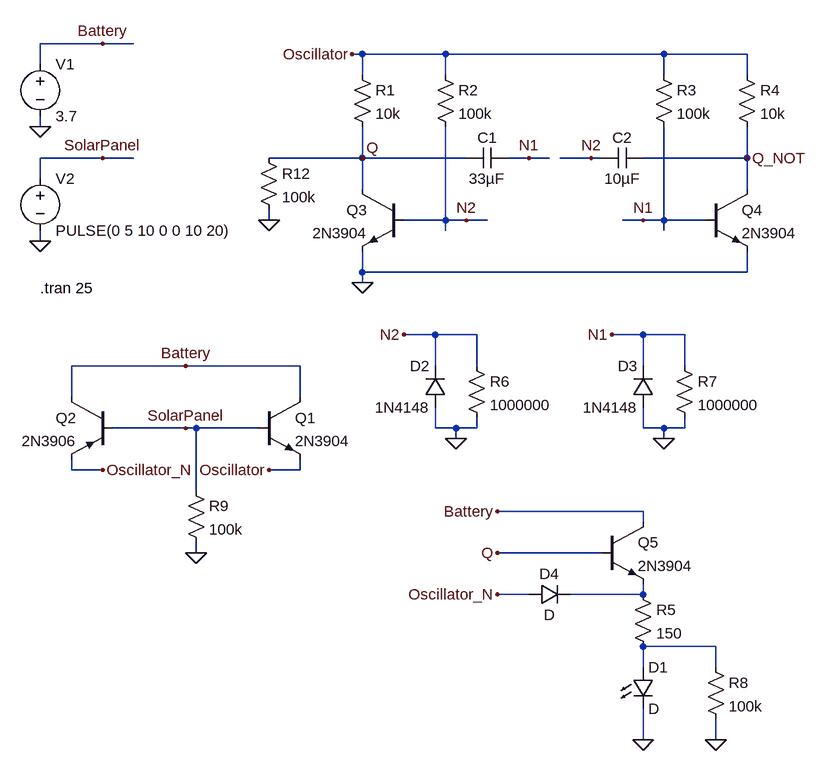
[diagram p0: schematic EE330_FinalProject_V2.asc]
EE330_FinalProject_V2.asc, the LTspice schematic file:
Version 4
SHEET 1 2304 1888
WIRE 256 32 160 32
WIRE 304 32 256 32
WIRE 656 48 640 48
WIRE 784 48 656 48
WIRE 1120 48 784 48
WIRE 1248 48 1120 48
WIRE 160 64 160 32
WIRE 656 80 656 48
WIRE 784 80 784 48
WIRE 1120 80 1120 48
WIRE 1248 80 1248 48
WIRE 160 160 160 144
WIRE 256 208 160 208
WIRE 304 208 256 208
WIRE 656 208 656 160
WIRE 656 208 512 208
WIRE 816 208 656 208
WIRE 912 208 880 208
WIRE 944 208 912 208
WIRE 1008 208 960 208
WIRE 1024 208 1008 208
WIRE 1248 208 1248 160
WIRE 1248 208 1088 208
WIRE 160 240 160 208
WIRE 656 256 656 208
WIRE 1248 256 1248 208
WIRE 512 304 512 288
WIRE 784 304 784 160
WIRE 784 304 720 304
WIRE 816 304 784 304
WIRE 848 304 816 304
WIRE 1088 304 1056 304
WIRE 1120 304 1120 160
WIRE 1120 304 1088 304
WIRE 1184 304 1120 304
WIRE 784 320 784 304
WIRE 1120 320 1120 304
WIRE 160 336 160 320
WIRE 656 384 656 352
WIRE 1248 384 1248 352
WIRE 1248 384 656 384
WIRE 656 400 656 384
WIRE 768 480 720 480
WIRE 832 480 768 480
WIRE 1088 480 1040 480
WIRE 1152 480 1088 480
WIRE 384 528 208 528
WIRE 560 528 384 528
WIRE 768 528 768 480
WIRE 832 528 832 480
WIRE 1088 528 1088 480
WIRE 1152 528 1152 480
WIRE 208 576 208 528
WIRE 560 576 560 528
WIRE 384 624 272 624
WIRE 400 624 384 624
WIRE 496 624 400 624
WIRE 768 624 768 592
WIRE 800 624 768 624
WIRE 832 624 832 608
WIRE 832 624 800 624
WIRE 1088 624 1088 592
WIRE 1120 624 1088 624
WIRE 1152 624 1152 608
WIRE 1152 624 1120 624
WIRE 400 720 400 624
WIRE 800 640 800 624
WIRE 1120 640 1120 624
WIRE 208 688 208 672
WIRE 256 688 208 688
WIRE 560 688 560 672
WIRE 560 688 512 688
WIRE 1088 752 864 752
WIRE 1088 768 1088 752
WIRE 400 816 400 800
WIRE 1024 816 864 816
WIRE 912 880 864 880
WIRE 1088 880 1088 864
WIRE 1088 880 976 880
WIRE 1200 960 1088 960
WIRE 1088 992 1088 960
WIRE 1200 992 1200 960
WIRE 1088 1104 1088 1056
WIRE 1200 1104 1200 1072
FLAG 160 336 0
FLAG 160 160 0
FLAG 256 32 Battery
FLAG 256 208 SolarPanel
FLAG 384 624 SolarPanel
FLAG 912 208 N1
FLAG 1088 304 N1
FLAG 1008 208 N2
FLAG 816 304 N2
FLAG 656 400 0
FLAG 384 528 Battery
FLAG 864 816 Q
FLAG 1248 208 Q_NOT
FLAG 1088 1104 0
FLAG 720 480 N2
FLAG 1040 480 N1
FLAG 800 640 0
FLAG 1120 640 0
FLAG 512 688 Oscillator
FLAG 256 688 Oscillator_N
FLAG 1200 1104 0
FLAG 864 752 Battery
FLAG 640 48 Oscillator
FLAG 864 880 Oscillator_N
FLAG 656 208 Q
FLAG 512 304 0
FLAG 400 816 0
SYMBOL Voltage 160 48 R0
SYMATTR InstName V1
SYMATTR Value 3.7
SYMBOL Voltage 160 224 R0
SYMATTR InstName V2
SYMATTR Value PULSE(0 5 10 0 0 10 20)
SYMBOL npn 720 256 M0
SYMATTR InstName Q3
SYMATTR Value 2N3904
SYMBOL npn 1184 256 R0
SYMATTR InstName Q4
SYMATTR Value 2N3904
SYMBOL Cap 880 192 R90
WINDOW 0 0 32 VBottom 2
WINDOW 3 32 32 VTop 2
SYMATTR InstName C1
SYMATTR Value 33µF
SYMBOL Cap 1088 192 R90
WINDOW 0 0 32 VBottom 2
WINDOW 3 32 32 VTop 2
SYMATTR InstName C2
SYMATTR Value 10µF
SYMBOL Res 768 64 R0
SYMATTR InstName R2
SYMATTR Value 100k
SYMBOL Res 640 64 R0
SYMATTR InstName R1
SYMATTR Value 10k
SYMBOL Res 1104 64 R0
SYMATTR InstName R3
SYMATTR Value 100k
SYMBOL Res 1232 64 R0
SYMATTR InstName R4
SYMATTR Value 10k
SYMBOL LED 1072 992 R0
SYMATTR InstName D1
SYMBOL Res 1072 864 R0
SYMATTR InstName R5
SYMATTR Value 150
SYMBOL diode 784 592 R180
WINDOW 0 24 64 Left 2
WINDOW 3 24 0 Left 2
SYMATTR InstName D2
SYMATTR Value 1N4148
SYMBOL Res 816 512 R0
SYMATTR InstName R6
SYMATTR Value 1000000
SYMBOL diode 1104 592 R180
WINDOW 0 24 64 Left 2
WINDOW 3 24 0 Left 2
SYMATTR InstName D3
SYMATTR Value 1N4148
SYMBOL Res 1136 512 R0
SYMATTR InstName R7
SYMATTR Value 1000000
SYMBOL npn 496 576 R0
SYMATTR InstName Q1
SYMATTR Value 2N3904
SYMBOL pnp 272 576 M0
SYMATTR InstName Q2
SYMATTR Value 2N3906
SYMBOL npn 1024 768 R0
SYMATTR InstName Q5
SYMATTR Value 2N3904
SYMBOL Res 1184 976 R0
SYMATTR InstName R8
SYMATTR Value 100k
SYMBOL Diode 912 896 R270
WINDOW 0 32 32 VTop 2
WINDOW 3 0 32 VBottom 2
SYMATTR InstName D4
SYMBOL Res 496 192 R0
SYMATTR InstName R12
SYMATTR Value 100k
SYMBOL Res 384 704 R0
SYMATTR InstName R9
SYMATTR Value 100k
TEXT 160 408 Left 2 !.tran 25

The netlist it stands for:
* EE330_FinalProject_V2.asc
V1 Battery 0 3.7
V2 SolarPanel 0 PULSE(0 5 10 0 0 10 20)
Q3 Q N2 0 0 2N3904
Q4 Q_NOT N1 0 0 2N3904
C1 N1 Q 33µF
C2 Q_NOT N2 10µF
R2 Oscillator N2 100k
R1 Oscillator Q 10k
R3 Oscillator N1 100k
R4 Oscillator Q_NOT 10k
D1 N002 0 D
R5 N001 N002 150
D2 0 N2 1N4148
R6 N2 0 1000000
D3 0 N1 1N4148
R7 N1 0 1000000
Q1 Battery SolarPanel Oscillator 0 2N3904
Q2 Battery SolarPanel Oscillator_N 0 2N3906
Q5 Battery Q N001 0 2N3904
R8 N002 0 100k
D4 Oscillator_N N001 D
R12 Q 0 100k
R9 SolarPanel 0 100k
.model D D
.lib standard.dio
.model NPN NPN
.model PNP PNP
.lib standard.bjt
.tran 25
.backanno
.end